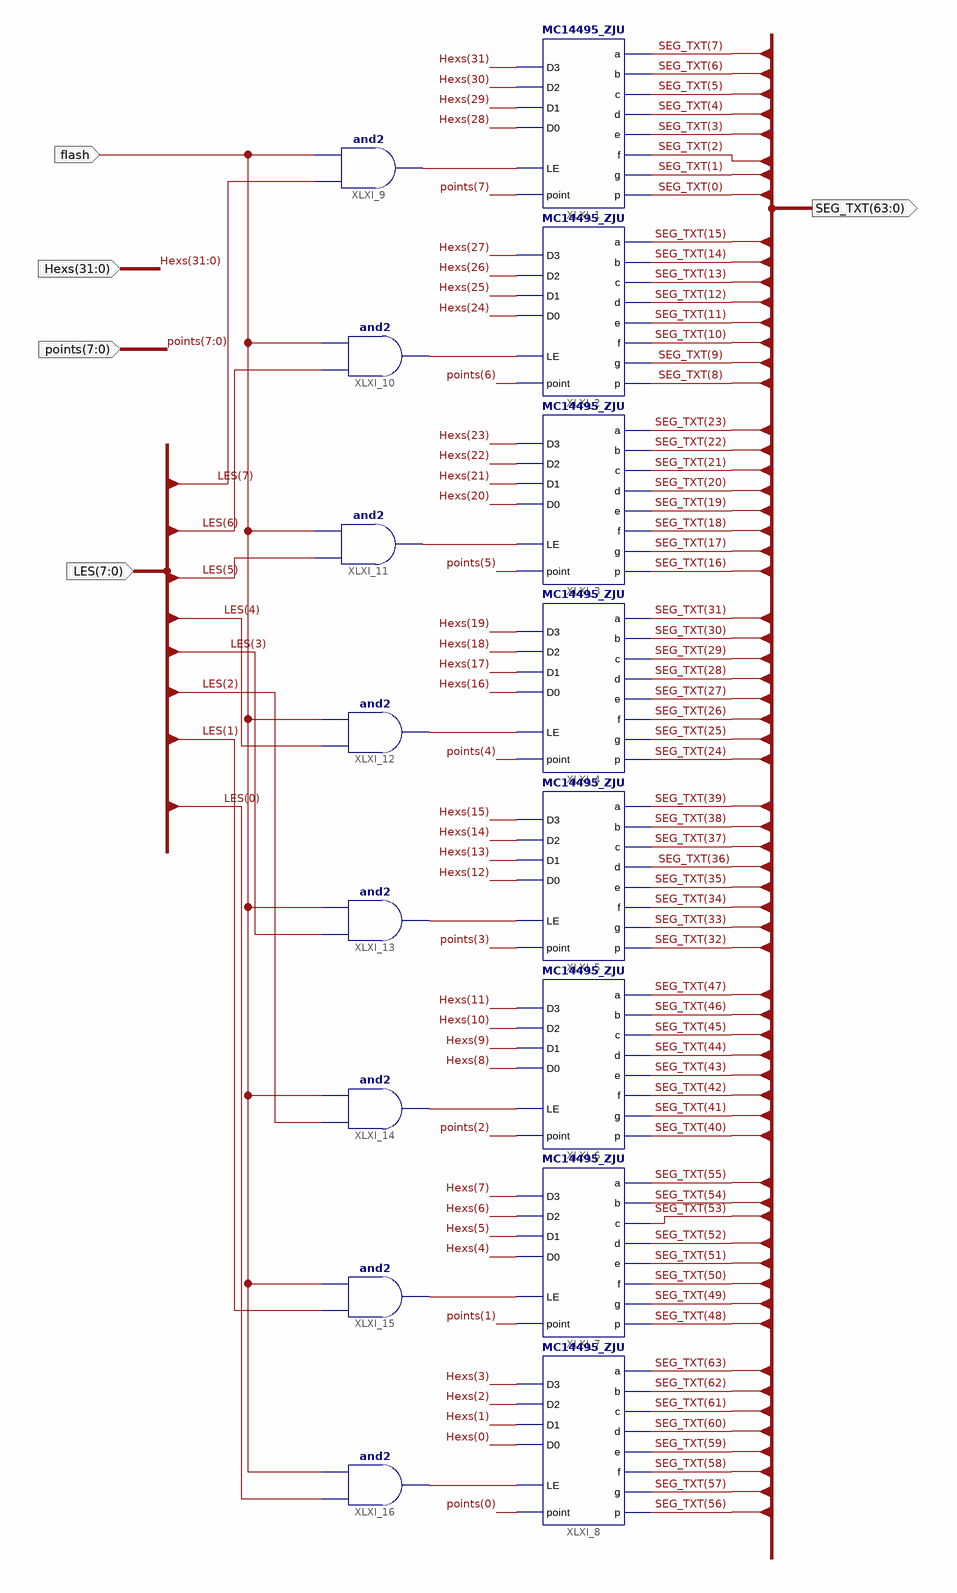
[diagram p0: schematic sheet 1]
// Xilinx ISE schematic HexTo8SEG.sch (kintex7) as structural Verilog: 16 symbols, 5 ports
module HexTo8SEG (
  input  [31:0] Hexs,
  input  [7:0] points,
  input  flash,
  input  [7:0] LES,
  output [63:0] SEG_TXT
);

  wire XLXN_43, XLXN_44, XLXN_45, XLXN_46, XLXN_47, XLXN_48, XLXN_49, XLXN_50;

  MC14495_ZJU XLXI_1 (
    .D0(Hexs[28]), .D1(Hexs[29]), .D2(Hexs[30]), .D3(Hexs[31]), .p(SEG_TXT[0]), .g(SEG_TXT[1]),
    .f(SEG_TXT[2]), .e(SEG_TXT[3]), .d(SEG_TXT[4]), .c(SEG_TXT[5]), .b(SEG_TXT[6]), .a(SEG_TXT[7]),
    .point(points[7]), .LE(XLXN_43));
  MC14495_ZJU XLXI_2 (
    .D0(Hexs[24]), .D1(Hexs[25]), .D2(Hexs[26]), .D3(Hexs[27]), .p(SEG_TXT[8]), .g(SEG_TXT[9]),
    .f(SEG_TXT[10]), .e(SEG_TXT[11]), .d(SEG_TXT[12]), .c(SEG_TXT[13]), .b(SEG_TXT[14]), .a(SEG_TXT[15]),
    .point(points[6]), .LE(XLXN_44));
  MC14495_ZJU XLXI_3 (
    .D0(Hexs[20]), .D1(Hexs[21]), .D2(Hexs[22]), .D3(Hexs[23]), .p(SEG_TXT[16]), .g(SEG_TXT[17]),
    .f(SEG_TXT[18]), .e(SEG_TXT[19]), .d(SEG_TXT[20]), .c(SEG_TXT[21]), .b(SEG_TXT[22]), .a(SEG_TXT[23]),
    .point(points[5]), .LE(XLXN_45));
  MC14495_ZJU XLXI_4 (
    .D0(Hexs[16]), .D1(Hexs[17]), .D2(Hexs[18]), .D3(Hexs[19]), .p(SEG_TXT[24]), .g(SEG_TXT[25]),
    .f(SEG_TXT[26]), .e(SEG_TXT[27]), .d(SEG_TXT[28]), .c(SEG_TXT[29]), .b(SEG_TXT[30]), .a(SEG_TXT[31]),
    .point(points[4]), .LE(XLXN_46));
  MC14495_ZJU XLXI_5 (
    .D0(Hexs[12]), .D1(Hexs[13]), .D2(Hexs[14]), .D3(Hexs[15]), .p(SEG_TXT[32]), .g(SEG_TXT[33]),
    .f(SEG_TXT[34]), .e(SEG_TXT[35]), .d(SEG_TXT[36]), .c(SEG_TXT[37]), .b(SEG_TXT[38]), .a(SEG_TXT[39]),
    .point(points[3]), .LE(XLXN_47));
  MC14495_ZJU XLXI_6 (
    .D0(Hexs[8]), .D1(Hexs[9]), .D2(Hexs[10]), .D3(Hexs[11]), .p(SEG_TXT[40]), .g(SEG_TXT[41]),
    .f(SEG_TXT[42]), .e(SEG_TXT[43]), .d(SEG_TXT[44]), .c(SEG_TXT[45]), .b(SEG_TXT[46]), .a(SEG_TXT[47]),
    .point(points[2]), .LE(XLXN_48));
  MC14495_ZJU XLXI_7 (
    .D0(Hexs[4]), .D1(Hexs[5]), .D2(Hexs[6]), .D3(Hexs[7]), .p(SEG_TXT[48]), .g(SEG_TXT[49]),
    .f(SEG_TXT[50]), .e(SEG_TXT[51]), .d(SEG_TXT[52]), .c(SEG_TXT[53]), .b(SEG_TXT[54]), .a(SEG_TXT[55]),
    .point(points[1]), .LE(XLXN_49));
  MC14495_ZJU XLXI_8 (
    .D0(Hexs[0]), .D1(Hexs[1]), .D2(Hexs[2]), .D3(Hexs[3]), .p(SEG_TXT[56]), .g(SEG_TXT[57]),
    .f(SEG_TXT[58]), .e(SEG_TXT[59]), .d(SEG_TXT[60]), .c(SEG_TXT[61]), .b(SEG_TXT[62]), .a(SEG_TXT[63]),
    .point(points[0]), .LE(XLXN_50));
  and XLXI_9 (XLXN_43, LES[7], flash);
  and XLXI_10 (XLXN_44, LES[6], flash);
  and XLXI_11 (XLXN_45, LES[5], flash);
  and XLXI_12 (XLXN_46, LES[4], flash);
  and XLXI_13 (XLXN_47, LES[3], flash);
  and XLXI_14 (XLXN_48, LES[2], flash);
  and XLXI_15 (XLXN_49, LES[1], flash);
  and XLXI_16 (XLXN_50, LES[0], flash);
endmodule
